# Altium schematic sheet MPU6050.SchDoc
size A4
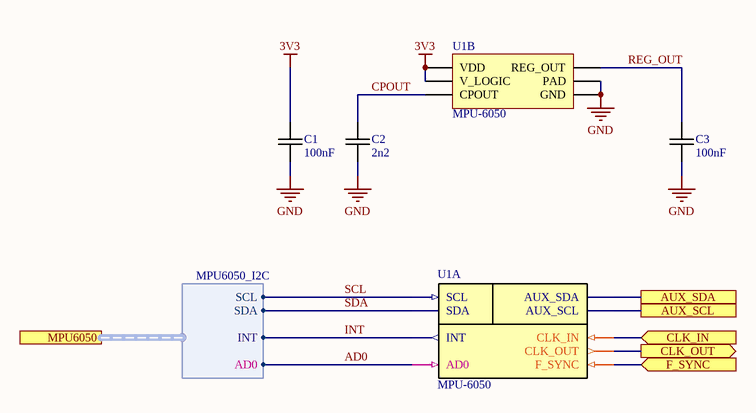
[diagram p0: MPU6050.SchDoc]

## Parts
C1  100nF  [0603C-GENERIC]
C2  2n2  [0603C-GENERIC]
C3  100nF  [0603C-GENERIC]
U1  MPU-6050  [QFN24]  (parts A,B of 2)

## Ports
AUX_SCL, AUX_SDA, CLK_IN (in), CLK_OUT (out), F_SYNC (in), MPU6050 (harness MPU6050_I2C)

## Harnesses
MPU6050_I2C: SDA, SCL, INT, AD0

## Nets
3V3: C1.2 U1.8(V_LOGIC) U1.13(VDD)
GND: C1.1 C2.1 C3.1 U1.18(GND) U1.25(PAD)
AD0: U1.9(AD0) ; port MPU6050.AD0
AUX_SCL: U1.7(AUX_SCL) ; port AUX_SCL
AUX_SDA: U1.6(AUX_SDA) ; port AUX_SDA
CLK_IN: U1.1(CLK_IN) ; port CLK_IN
CLK_OUT: U1.22(CLK_OUT) ; port CLK_OUT
CPOUT: C2.2 U1.20(CPOUT)
F_SYNC: U1.11(F_SYNC) ; port F_SYNC
INT: U1.12(INT) ; port MPU6050.INT
REG_OUT: C3.2 U1.10(REG_OUT)
SCL: U1.23(SCL) ; port MPU6050.SCL
SDA: U1.24(SDA) ; port MPU6050.SDA

## Library data of the parts
C1 C3 = 0603C-100NF-50V-X7R-TDK: CAPACITOR 0603 CERAMIC; Manufacturer Part Number: C1608X7R1H103K; Manufacturer: TDK Corporation; Temperature Coefficient: X7R; Tolerance: ±10%; Voltage - Rated: 50V; Capacitance: 10000pF; Reel: C68; RoHS: RoHS Compliant; Lead Spacing: -; Package / Case: 0603 (1608 metric); Features: General Purpose; Packaging: Tape & Reel (TR); Thickness: 0.80mm; Operating Temperature: -55°C ~ 125°C; Mounting Type: Surface Mount, MLCC; Category: Capacitors; Supplier 1: Digi-Key; Supplier Part Number 1: 445-1314-2-ND
C2 = 0603C-2N2-50V-C0G-MUR: CAPACITOR 0603 CERAMIC; Reel: C4
U1 = MPU-6050: Integrated 6-axis 3D accelerometer I2c interface